# Altium schematic sheet Indication.SchDoc
size 420 x 297 mm; Address1: Address1; Address2: Address2; Address3: Address3; Address4: Address4; DocumentNumber: *Э3; SheetNumber: 6; SheetTotal: 12; DocumentType: Схема электрическая *
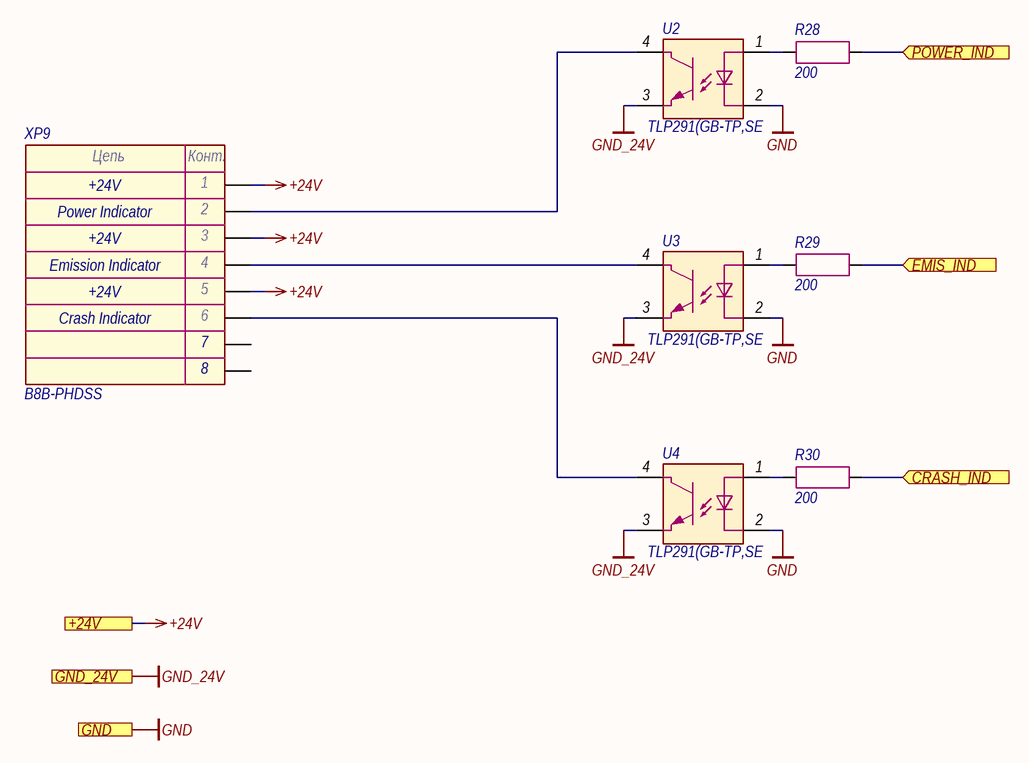
[diagram p0: Indication.SchDoc]

## Parts
R28  200  [RES_0603]
R29  200  [RES_0603]
R30  200  [RES_0603]
U2  TLP291(GB-TP,SE  [11-3C1]
U3  TLP291(GB-TP,SE  [11-3C1]
U4  TLP291(GB-TP,SE  [11-3C1]
XP9  B8B-PHDSS  [B8B-PHDSS]

## Ports
+24V (see Main[2A], Bus[1D], Button[1C], Column[1C], Flow_sensor[2C], Hardwiring[3C]), CRASH_IND (in, see Main[3A]), EMIS_IND (in, see Main[3A]), GND (see Main[2A], Bus[1D], Button[1D], Column[1C], Ethernet[3D], Fiber_interlock[2C], Flow_sensor[2C], Guide_laser[1C], Hardwiring[3D]), GND_24V (see Main[2A], Bus[1D], Button[1D], Column[1C], Flow_sensor[2C], Hardwiring[3C]), POWER_IND (in, see Main[3A])

## Nets
+24V: XP9.1 XP9.3 XP9.5 ; port +24V
GND: U2.2 U3.2 U4.2 ; port GND
GND_24V: U2.3 U3.3 U4.3 ; port GND_24V
CRASH_IND: R30.2 ; port CRASH_IND
EMIS_IND: R29.2 ; port EMIS_IND
POWER_IND: R28.2 ; port POWER_IND
NetR28_1: R28.1 U2.1
NetR29_1: R29.1 U3.1
NetR30_1: R30.1 U4.1
NetU2_4: U2.4 XP9.2
NetU3_4: U3.4 XP9.4
NetU4_4: U4.4 XP9.6

Not connected (* = marked no-connect by the designer): XP9 7 8

## Notes on the sheet
- Power Indicator
- +24V
- (near XP9) Emission Indicator
- Crash Indicator
- Подп. и дата
- Инв. № дубл.
- Взам. инв. №
- Инв. № подл.
- Изм.
- Лист
- № докум.
- Подп.
- Дата
- Копировал
- Формат А3
- (in symbol Connector-8) Цепь; Конт.

## Library data of the parts
R28-R30 = Resistor: Manufacturer: Yageo; Model: RC0603FR-07200RL; Value: 200; Document: *
U2-U4 = TLP291: Manufacturer: Toshiba; Model: TLP291(GB-TP,SE; Document: *
XP9 = Connector-8: Manufacturer: JST; Model: B8B-PHDSS; Document: *